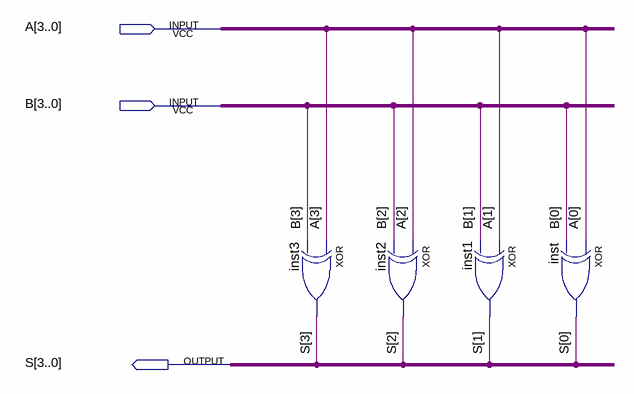
[diagram p0: schematic sheet]
// Quartus schematic XOR.bdf as structural Verilog: 4 symbols, 3 pins
module XOR (
  input  [3:0] A,
  input  [3:0] B,
  output [3:0] S
);

  xor inst3 (S[3], A[3], B[3]);
  xor inst2 (S[2], A[2], B[2]);
  xor inst1 (S[1], A[1], B[1]);
  xor inst (S[0], A[0], B[0]);
endmodule
